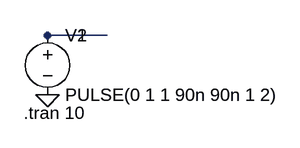
[diagram p0: schematic Draft4.asc]
Draft4.asc, the LTspice schematic file:
Version 4
SHEET 1 880 680
WIRE 224 96 144 96
FLAG 144 176 0
SYMBOL voltage 144 80 R0
WINDOW 123 0 0 Left 0
WINDOW 39 0 0 Left 0
SYMATTR InstName V1
SYMATTR Value PULSE(0 1 1 90n 90n 1 2)
SYMBOL voltage 144 80 R0
WINDOW 123 0 0 Left 0
WINDOW 39 0 0 Left 0
SYMATTR InstName V2
SYMATTR Value PULSE(0 1 1 90n 90n 1 2)
TEXT 112 200 Left 2 !.tran 10

The netlist it stands for:
* Draft4.asc
V1 N001 0 PULSE(0 1 1 90n 90n 1 2)
V2 N001 0 PULSE(0 1 1 90n 90n 1 2)
.tran 10
.backanno
.end